# Altium schematic sheet Top.SchDoc
size A4; SheetNumber: 1; SheetTotal: 4
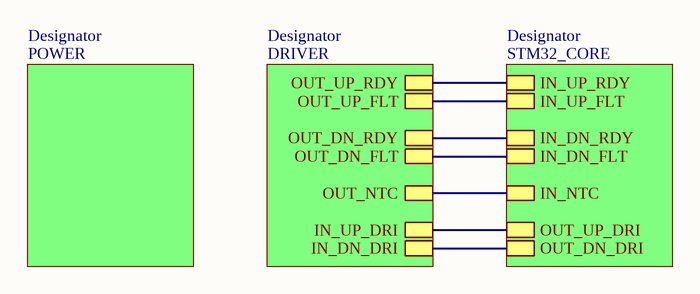
[diagram p0: Top.SchDoc]

## Sub-sheets
Designator = DRIVER: OUT_UP_RDY, OUT_UP_FLT, OUT_DN_RDY, OUT_DN_FLT, OUT_NTC, IN_UP_DRI, IN_DN_DRI
Designator = STM32_CORE: IN_UP_RDY, IN_UP_FLT, IN_DN_RDY, IN_DN_FLT, IN_NTC, OUT_UP_DRI, OUT_DN_DRI
Designator = POWER: no entries

## Nets
(unnamed): sheet Designator/OUT_UP_RDY, sheet Designator/IN_UP_RDY
(unnamed): sheet Designator/OUT_UP_FLT, sheet Designator/IN_UP_FLT
(unnamed): sheet Designator/OUT_DN_RDY, sheet Designator/IN_DN_RDY
(unnamed): sheet Designator/OUT_DN_FLT, sheet Designator/IN_DN_FLT
(unnamed): sheet Designator/OUT_NTC, sheet Designator/IN_NTC
(unnamed): sheet Designator/IN_UP_DRI, sheet Designator/OUT_UP_DRI
(unnamed): sheet Designator/IN_DN_DRI, sheet Designator/OUT_DN_DRI